# EasyEDA Pro project RCKid.epro, schematic Cartridge Connector
Board Name: Cartridge Connector_1; Create Date: 2025-03-29; Page Name: Connector; Project Name: rckid; Schematic Name: Cartridge Connector_1; Update Date: 2025-04-04; Company: EasyEDA.com; Page Size: A4; Version: V1.0
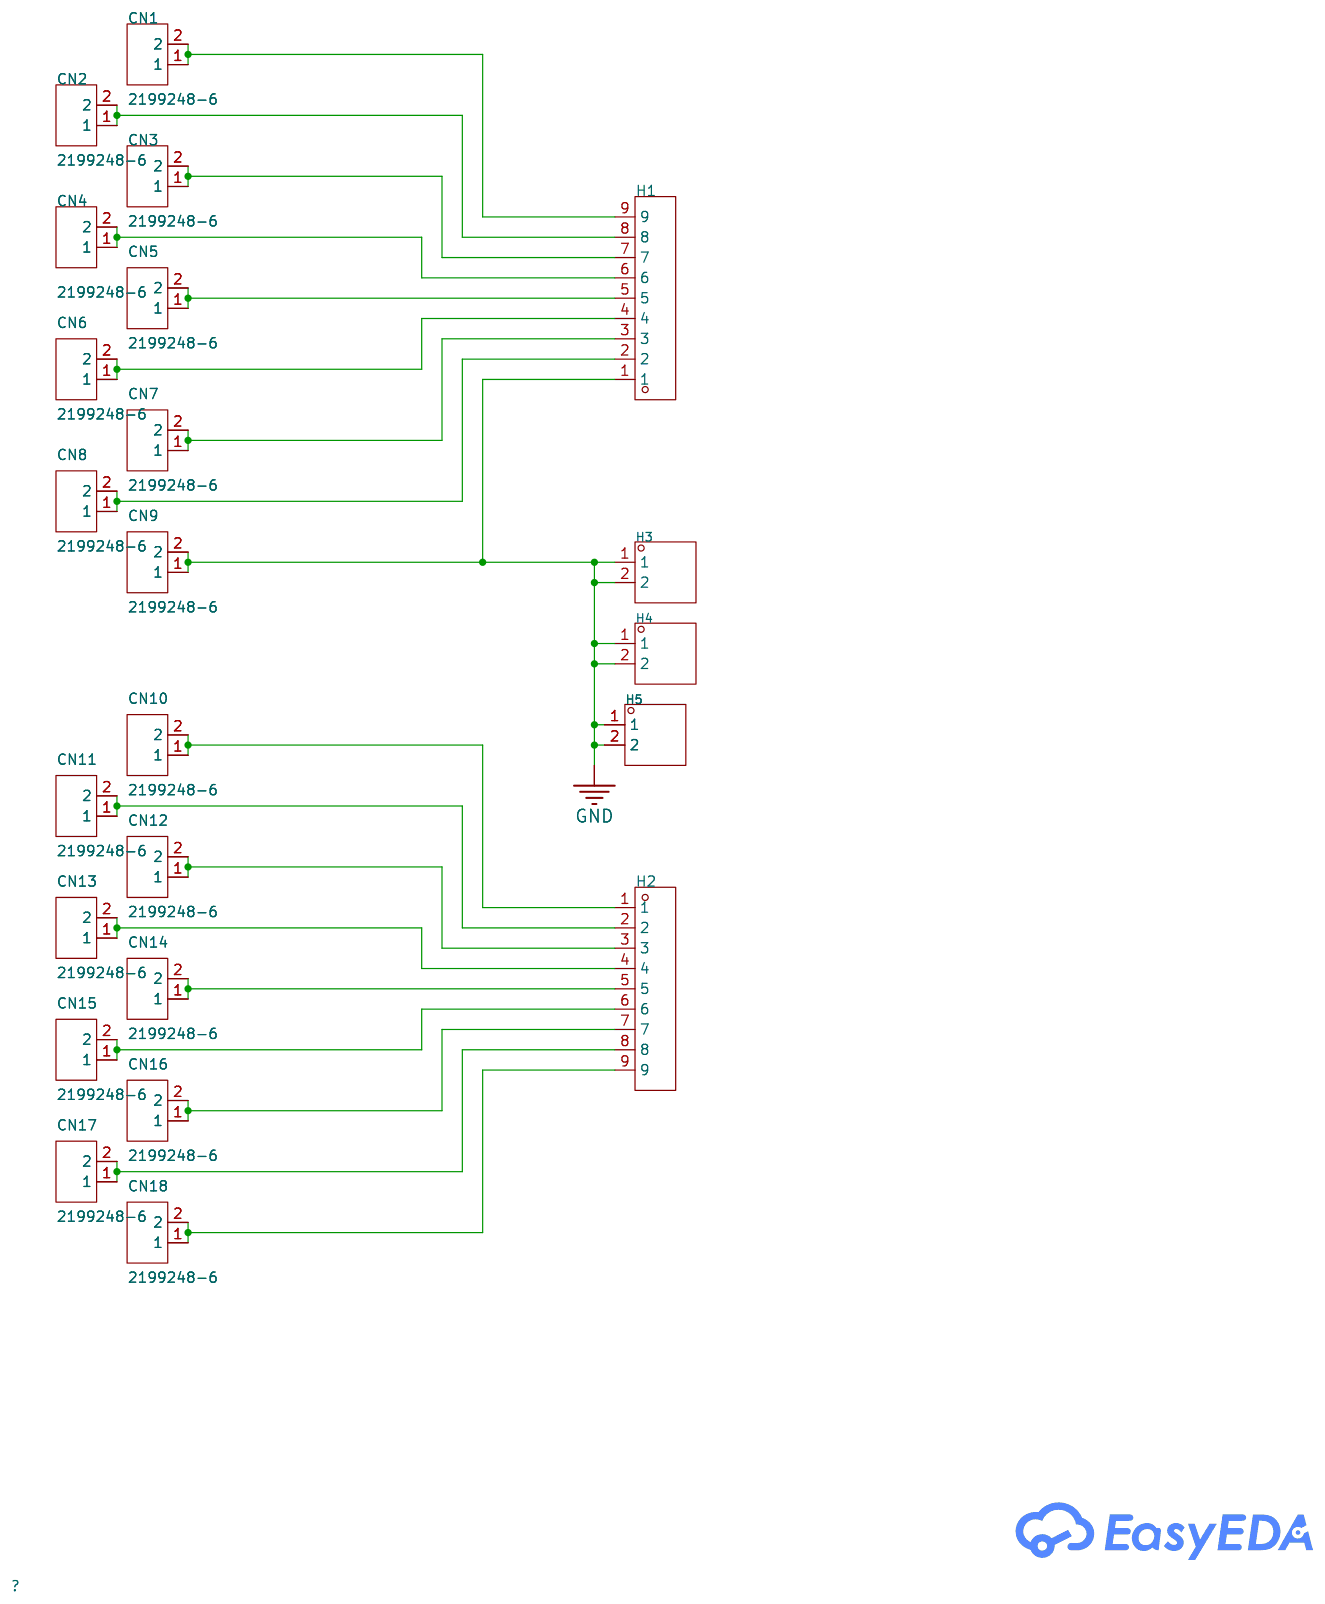
[diagram p1: schematic sheet]

## Parts
CN1  2199248-6  [SMD_2199248-5]
CN2  2199248-6  [SMD_2199248-5]
CN3  2199248-6  [SMD_2199248-5]
CN4  2199248-6  [SMD_2199248-5]
CN5  2199248-6  [SMD_2199248-5]
CN6  2199248-6  [SMD_2199248-5]
CN7  2199248-6  [SMD_2199248-5]
CN8  2199248-6  [SMD_2199248-5]
CN9  2199248-6  [SMD_2199248-5]
CN10  2199248-6  [SMD_2199248-5]
CN11  2199248-6  [SMD_2199248-5]
CN12  2199248-6  [SMD_2199248-5]
CN13  2199248-6  [SMD_2199248-5]
CN14  2199248-6  [SMD_2199248-5]
CN15  2199248-6  [SMD_2199248-5]
CN16  2199248-6  [SMD_2199248-5]
CN17  2199248-6  [SMD_2199248-5]
CN18  2199248-6  [SMD_2199248-5]
H1  -  [HDR-TH_9P-P2.54-V-M]  (no BOM)
H2  -  [HDR-TH_9P-P2.54-V-M]  (no BOM)
H3  -  [HDR-TH_2P-P2.54-V-M-1]  (no BOM)
H4  -  [HDR-TH_2P-P2.54-V-M-1]  (no BOM)
H5  -  [HDR-TH_2P-P2.54-V-M-1]  (no BOM)

## Library data of the parts
CN1-CN18 = 2199248-6: LCSC Part Name: TE Connectivity(泰科电子) 弹片 3.9mmx2.4mmx1.6mm 不锈钢 镀金 圆盘; Supplier Part: C3308715; Manufacturer: TE Connectivity(泰科电子); JLCPCB Part Class: Extended Part; Datasheet: https://atta.szlcsc.com/upload/public/pdf/source/20250219/FD6C0EAE8070198A62B241A1E31EF73C.pdf; Supplier: LCSC
H1 H2 = HDR-M_2.54-1x9P: Supplier Footprint: Through
H3-H5 = HDR-M_2.54_1x2P: Supplier Footprint: Through

## Nets
GND: CN9.1 CN9.2 H1.1 H3.1 H3.2 H4.1 H4.2 H5.1 H5.2
$1N2052: CN1.1 CN1.2 H1.9
$1N2058: CN2.1 CN2.2 H1.8
$1N2065: CN3.1 CN3.2 H1.7
$1N2075: CN4.1 CN4.2 H1.6
$1N2082: CN5.1 CN5.2 H1.5
$1N2087: CN6.1 CN6.2 H1.4
$1N2094: CN7.1 CN7.2 H1.3
$1N2101: CN8.1 CN8.2 H1.2
$1N2108: CN18.1 CN18.2 H2.9
$1N2118: CN17.1 CN17.2 H2.8
$1N2128: CN16.1 CN16.2 H2.7
$1N2135: CN15.1 CN15.2 H2.6
$1N2147: CN13.1 CN13.2 H2.4
$1N2154: CN12.1 CN12.2 H2.3
$1N2161: CN11.1 CN11.2 H2.2
$1N2168: CN10.1 CN10.2 H2.1
$1N7583: CN14.1 CN14.2 H2.5
